# Altium schematic sheet 03.Display.SchDoc
size A4; Organization: Electronic and Telecommunication Department - University of Moratuwa; Address1: Bandaranayake Mawatha; Address2: Moratuwa; Address3: Sri Lanka; Address4: 10400; DocumentNumber: 03; SheetNumber: 3; SheetTotal: 4; Page: Output voltage display
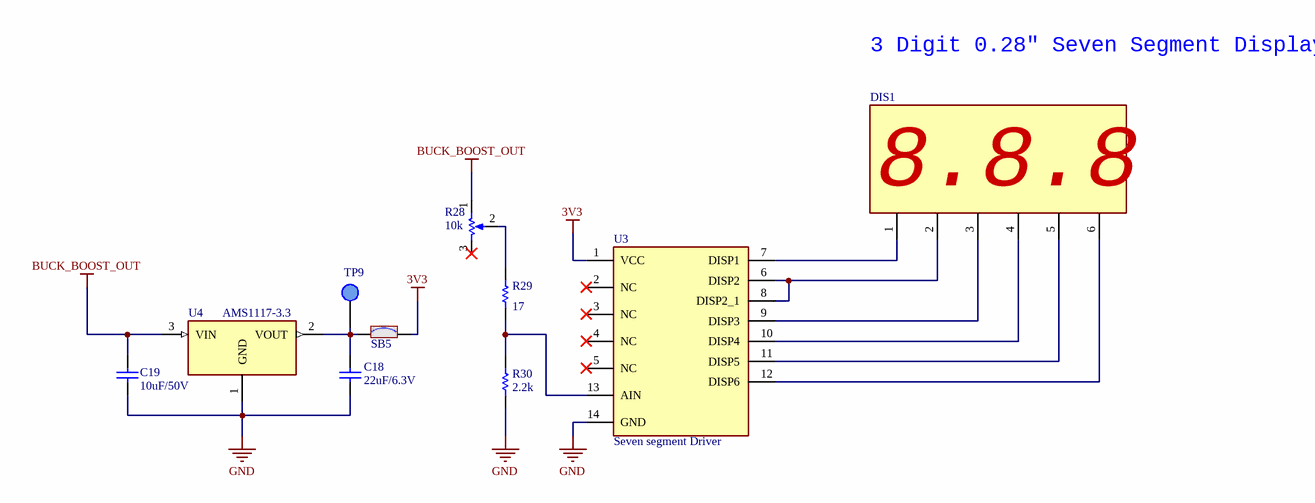
[diagram p0: 03.Display.SchDoc]

## Parts
C18  22uF/6.3V  [cap0805]
C19  10uF/50V  [cap0805]
DIS1  6pin 3 digit seven segment display module  [7Segment-0.28inch]  (value not drawn)
R28  10k  [TRIM_TC33X-2-201G]
R29  17  [RES0805]
R30  2.2k  [RES0805]
SB5  SB_ON  [SOLDER-BRIDGE_R0805-0R]  (value not drawn)
TP9  (no value)  [tp]  (no BOM)
U3  Seven segment Driver  [SOIC127P600X175-14N]
U4  AMS1117-3.3  [SOT229P700X180-4N]

## Nets
3V3: SB5.2 U3.1(VCC)
BUCK_BOOST_OUT: C19.1 R28.1(TOP) U4.3(VIN)
GND: C18.2 C19.2 R30.1 U3.14(GND) U4.1(GND)
NetC18_1: C18.1 SB5.1 TP9.1(TP) U4.2(VOUT)
NetDIS1_1: DIS1.1 U3.7(DISP1)
NetDIS1_2: DIS1.2 U3.6(DISP2) U3.8(DISP2_1)
NetDIS1_3: DIS1.3 U3.9(DISP3)
NetDIS1_4: DIS1.4 U3.10(DISP4)
NetDIS1_5: DIS1.5 U3.11(DISP5)
NetDIS1_6: DIS1.6 U3.12(DISP6)
NetR28_2: R28.2(TAP) R29.2
NetR29_1: R29.1 R30.2 U3.13(AIN)

Not connected (* = marked no-connect by the designer): R28 3(BOT)*; U3 2(NC)* 3(NC)* 4(NC)* 5(NC)*

## Notes on the sheet
- 3 Digit 0.28" Seven Segment Display
- Title :
- Size:
- Date:
- Page :
- A4
- Number:
- Time:
- Revision:
- Sheet
- of
- Sheet Name :
- Drawn By :
- (in symbol SevenSegment6Pin) 8.8.8

## Library data of the parts
C18 = Cap: Multilayer Ceramic Capacitors MLCC - SMD/SMT 6.3V 22uF X5R 0805 20 %; MF: TAIYO YUDEN; MP: JMK212BJ226MG-T; MOUSER: 963-JMK212BJ226MG-T
C19 = Cap: Multilayer Ceramic Capacitors MLCC - SMD/SMT 10 uF 50 VDC 10% 0805 X5R; MF: Murata Electronics; MP: GRM21BR61H106KE43L; MOUSER: 81-GRM21BR61H106KE3L
DIS1 = SevenSegment6Pin
R28 = RPot: Potentiometer
R29 = Res: Thick Film Resistors - SMD 17.4OHM 1/10WATT 1%; MP: CR0603-FX-17R4ELF; MF: Bourns; MOUSER: 652-CR0603-FX17R4ELF
R30 = Res: Thin Film Resistors - SMD 2.2K ohm 1% 50 ppm Thin Film; MP: RT0805FRE132K2L; MF: YAGEO; MOUSER: 603-RT0805FRE132K2L
SB5 = SB_ON: Solder Bridge ON; MP: CR0805AJ/-000EAS; MF: Bourns; MOUSER: 652-CR0805AJ/-000EAS
TP9 = TP: Test Point
U3 = Seven segment Driver: ADC/MUX/Binary2BCD/BCDto7Segment; MF: ABLIC; MP: S-8254AAEFT-TB-G; MOUSER: 628-8254AAE-G
U4 = AMS1117-3.3: LDO Voltage Regulators 800MA LDO LINEAR REG; MF: Texas Instruments; MP: LM1117MPX-3.3/NOPB; MOUSER: 926-LM1117MPX3.3NOPB